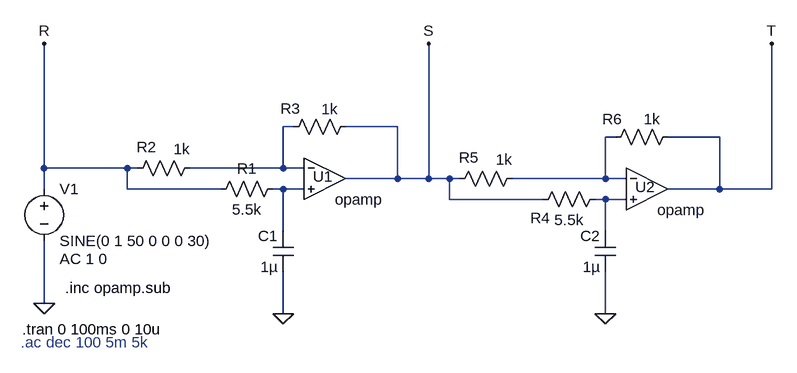
[diagram p0: schematic Circuito.asc]
Circuito.asc, the LTspice schematic file:
Version 4
SHEET 1 1104 680
WIRE 336 48 320 48
WIRE 496 48 416 48
WIRE 832 64 816 64
WIRE 992 64 912 64
WIRE -48 112 -48 -80
WIRE 80 112 -48 112
WIRE 96 112 80 112
WIRE 320 112 320 48
WIRE 320 112 176 112
WIRE 352 112 320 112
WIRE 496 128 496 48
WIRE 496 128 416 128
WIRE 544 128 544 -80
WIRE 544 128 496 128
WIRE 576 128 544 128
WIRE 592 128 576 128
WIRE 816 128 816 64
WIRE 816 128 672 128
WIRE 848 128 816 128
WIRE -48 144 -48 112
WIRE 80 144 80 112
WIRE 224 144 80 144
WIRE 320 144 304 144
WIRE 352 144 320 144
WIRE 992 144 992 64
WIRE 992 144 912 144
WIRE 1072 144 1072 -80
WIRE 1072 144 992 144
WIRE 576 160 576 128
WIRE 720 160 576 160
WIRE 816 160 800 160
WIRE 848 160 816 160
WIRE 320 208 320 144
WIRE 816 208 816 160
WIRE -48 320 -48 224
WIRE 320 336 320 272
WIRE 816 336 816 272
FLAG 320 336 0
FLAG -48 320 0
FLAG 816 336 0
FLAG -48 -80 R
FLAG 544 -80 S
FLAG 1072 -80 T
SYMBOL voltage -48 128 R0
WINDOW 123 24 124 Left 2
WINDOW 39 0 0 Left 0
SYMATTR InstName V1
SYMATTR Value SINE(0 1 50 0 0 0 30)
SYMATTR Value2 AC 1 0
SYMBOL cap 336 272 R180
WINDOW 0 24 56 Left 2
WINDOW 3 24 8 Left 2
SYMATTR InstName C1
SYMATTR Value 1µ
SYMBOL res 192 96 R90
WINDOW 0 -1 82 VBottom 2
WINDOW 3 -29 28 VTop 2
SYMATTR InstName R2
SYMATTR Value 1k
SYMBOL res 432 32 R90
WINDOW 0 4 101 VBottom 2
WINDOW 3 -27 40 VTop 2
SYMATTR InstName R3
SYMATTR Value 1k
SYMBOL OpAmps\\opamp 384 64 R0
WINDOW 0 -18 61 Left 2
SYMATTR InstName U1
SYMBOL res 816 144 R90
WINDOW 0 60 100 VBottom 2
WINDOW 3 32 56 VTop 2
SYMATTR InstName R4
SYMATTR Value 5.5k
SYMBOL cap 832 272 R180
WINDOW 0 24 56 Left 2
WINDOW 3 24 8 Left 2
SYMATTR InstName C2
SYMATTR Value 1µ
SYMBOL res 688 112 R90
WINDOW 0 -1 82 VBottom 2
WINDOW 3 -29 28 VTop 2
SYMATTR InstName R5
SYMATTR Value 1k
SYMBOL res 928 48 R90
WINDOW 0 4 101 VBottom 2
WINDOW 3 -27 40 VTop 2
SYMATTR InstName R6
SYMATTR Value 1k
SYMBOL OpAmps\\opamp 880 80 R0
WINDOW 0 -18 61 Left 2
SYMATTR InstName U2
SYMBOL res 208 160 R270
WINDOW 0 32 56 VTop 2
WINDOW 3 0 56 VBottom 2
SYMATTR InstName R1
SYMATTR Value 5.5k
TEXT -16 296 Left 2 !.inc opamp.sub
TEXT -82 360 Left 2 !.tran 0 100ms 0 10u
TEXT -84 380 Left 2 ;.ac dec 100 5m 5k

The netlist it stands for:
* Circuito.asc
V1 R 0 SINE(0 1 50 0 0 0 30) AC 1 0
C1 0 N003 1µ
R2 N001 R 1k
R3 S N001 1k
XU1 N001 N003 S opamp Aol=100K GBW=10Meg  ; pins invin noninvin out
R4 N004 S 5.5k
C2 0 N004 1µ
R5 N002 S 1k
R6 T N002 1k
XU2 N002 N004 T opamp Aol=100K GBW=10Meg  ; pins invin noninvin out
R1 R N003 5.5k
.inc opamp.sub
.tran 0 100ms 0 10u
* .ac dec 100 5m 5k
.backanno
.end